# EAGLE schematic Chocolate3Pi (EAGLE 9.0.1)
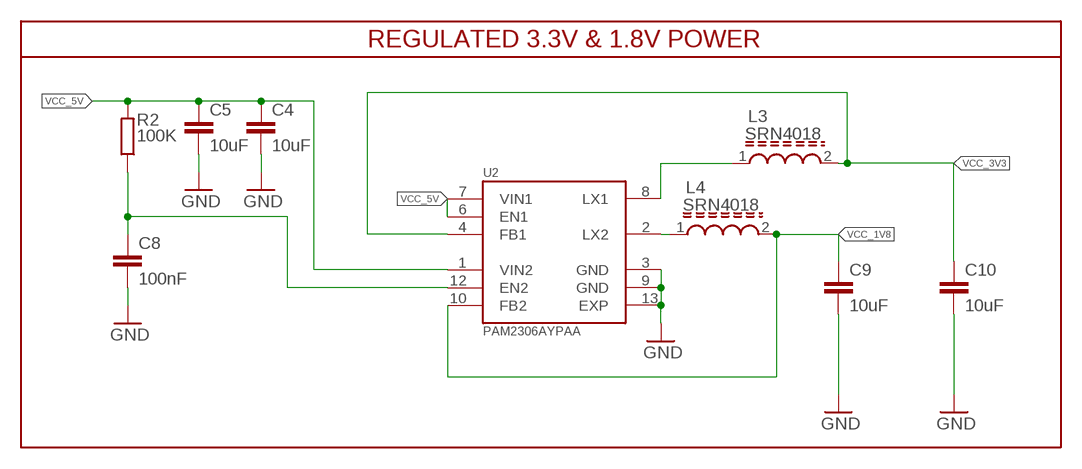
[diagram p0: schematic, sheet 1]

## Parts
C4  10uF  C-EUC0805  [C0805]
C5  10uF  C-EUC0805  [C0805]
C8  100nF  C-EUC0603  [C0603]
C9  10uF  C-EUC0805  [C0805]
C10  10uF  C-EUC0805  [C0805]
L3  SRN4018  [INDP4040X180N]
L4  SRN4018  [INDP4040X180N]
R2  100K  R-EU_R0603  [R0603]
U2  PAM2306AYPAA  [SON45P300X300X80-13N]

## Nets
GND: C4.2 C5.2 C8.2 C9.2 C10.2 U2.3(GND) U2.9(GND) U2.13(EXP)
N$4: L3.1 U2.8(LX1)
N$6: L4.1 U2.2(LX2)
N$8: C8.1 R2.1 U2.12(EN2)
VCC_1V8: C9.1 L4.2 U2.10(FB2)
VCC_3V3: C10.1 L3.2 U2.4(FB1)
VCC_5V: C4.1 C5.1 R2.2 U2.1(VIN2) U2.6(EN1) U2.7(VIN1)

## Notes on the sheet
- REGULATED 3.3V & 1.8V POWER

## Library data of the parts
C4 C5 C9 C10 = rcl:C-EU: CAPACITOR, European symbol; CID: 351; SPICEPREFIX: C
C8 = rcl:C-EU: CAPACITOR, European symbol; CID: 67; SPICEPREFIX: C
L3 L4 = SRN4018:SRN4018: Inductor Power Semi-Shielded Wirewound; CID: 352
R2 = rcl:R-EU_: RESISTOR, European symbol; CID: 157; SPICEPREFIX: R
U2 = PAM2306AYPAA:PAM2306AYPAA: PAM2306 Series 5.5V 1A Dual High Efficiency PWM Step Down DC-DC Converter-WDFN12; AVAILABILITY: Good; CID: 362; DESCRIPTION: IC REG BUCK ADJ 1A DL SYNC 12DFN; MF: Diodes Inc.; MP: PAM2306AYPAA; PACKAGE: WFDFN-12 Diodes Inc.; PRICE: 0.33 USD